# EAGLE schematic giarduino-v02 (EAGLE 5.10)
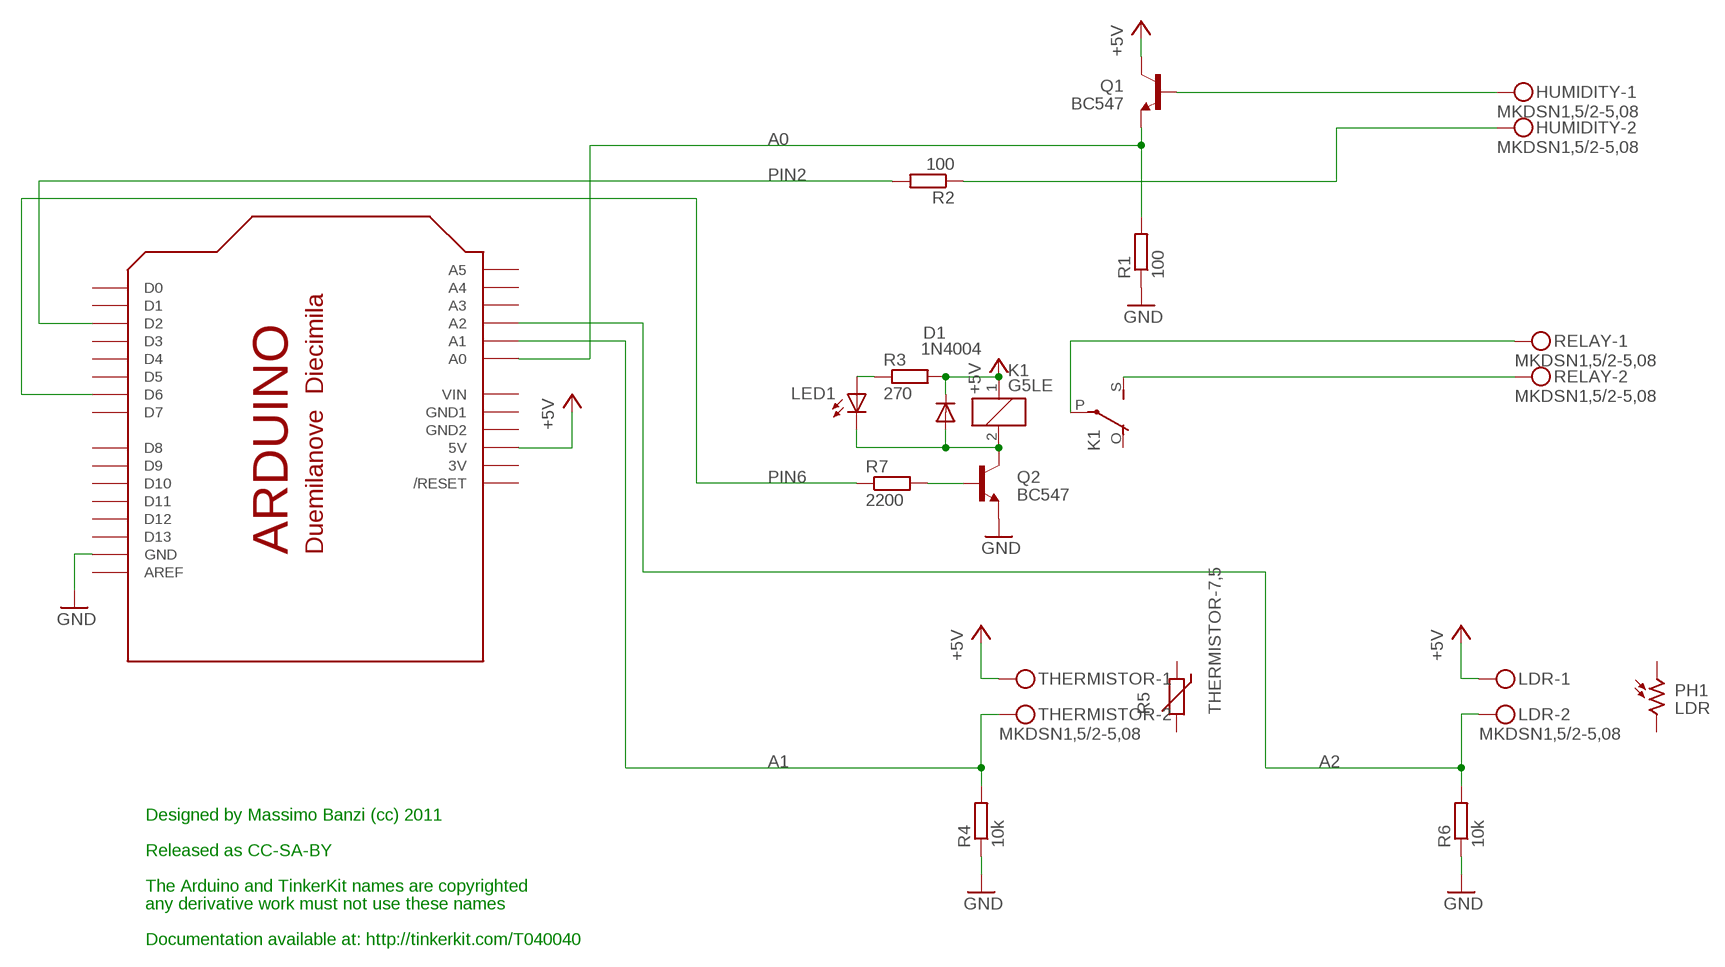
[diagram p0: schematic, sheet 1]

## Parts
D1  1N4004  [DO41-10]
HUMIDITY  MKDSN1,5/2-5,08  [MKDSN1,5/2-5,08]
K1  G5LE  [G5LE]
LDR  MKDSN1,5/2-5,08  [MKDSN1,5/2-5,08]
LED1  LED3MM  [LED3MM]
PH1  LDR  VT80N1  [VT800]
Q1  BC547  TRANSISTOR_NPNTO92  [TO-92]
Q2  BC547  TRANSISTOR_NPNTO92  [TO-92]
R1  100  R-EU_0207/10  [0207/10]
R2  100  R-EU_0207/10  [0207/10]
R3  270  R-EU_0207/10  [0207/10]
R4  10k  R-EU_0207/10  [0207/10]
R5  THERMISTOR-7,5  [R-7,5]
R6  10k  R-EU_0207/10  [0207/10]
R7  2200  R-EU_0207/10  [0207/10]
RELAY  MKDSN1,5/2-5,08  [MKDSN1,5/2-5,08]
THERMISTOR  MKDSN1,5/2-5,08  [MKDSN1,5/2-5,08]
U$1  ARDUINOUNO  [ARDUINO]

## Nets
+5V [pwr]: D1.C K1.1 LDR.1 Q1.3(C) R3.2 THERMISTOR.1 U$1.5V
A0: Q1.1(E) R1.2 U$1.A0
A1: R4.2 THERMISTOR.2 U$1.A1
A2: LDR.2 R6.2 U$1.A2
GND [pwr]: Q2.1(E) R1.1 R4.1 R6.1 U$1.GND
N$1: D1.A K1.2 LED1.K(C) Q2.3(C)
N$2: Q2.2(B) R7.2
N$3 [pwr]: K1.S(2:S) RELAY.2
N$4 [pwr]: K1.P(2:P) RELAY.1
N$11: LED1.A R3.1
N$13: HUMIDITY.2 R2.1
PIN2: R2.2 U$1.D2
PIN6: R7.1 U$1.D6
PROBE-TRANSISTORIN: HUMIDITY.1 Q1.2(B)
Unconnected: K1.O(2:O) PH1.1 PH1.2 R5.1 R5.2 U$1.A3 U$1.A4 U$1.A5 U$1.AREF U$1.D0 U$1.D1 U$1.D3 U$1.D4 U$1.D5 U$1.D7 U$1.D8 U$1.D9 U$1.D10 U$1.D11 U$1.D12 U$1.D13 U$1.RESET(/RESET)

## Notes on the sheet
- Designed by Massimo Banzi (cc) 2011
- Released as CC-SA-BY
- The Arduino and TinkerKit names are copyrighted
- any derivative work must not use these names
- Documentation available at: http://tinkerkit.com/T040040

## Power pins joined to a net without a drawn wire
3V: U$1.3V
GND1: U$1.GND1
GND2: U$1.GND2
VIN: U$1.VIN

## Library data of the parts
D1 = diode:1N4004: DIODE general purpose rectifier, 1 A
HUMIDITY LDR RELAY THERMISTOR = con-phoenix-508:MKDSN1,5/2-5,08: MKDSN 1,5/ 2-5,08 Printklemme Nennstrom: 13,5 A Nennspannung: 250 V Rastermaß: 5,08 mm Polzahl: 2 Anschlussart: Schraubanschluss Montage: Löten Anschlussrichtung Leiter/Platine: 0 ° Artikelnummer: 1729128 Source: http://eshop.phoenixcontact.com .. 1729128.pdf
K1 = relay:G5LE: RELAY 1 x switch, 10 A/120 V AC, 8 A/30 V DC, Omron
LED1 = SparkFun:LED: LEDs Standard schematic elements and footprints for 5mm, 3mm, 1206, and 0603 sized LEDs. 5mm - Spark Fun Electronics SKU : COM-00529 (and others)
PH1 = photo-elements:VT8: Photoconductive Cell VT800 Series Source: http://optoelectronics.perkinelmer.com/content/Datasheets/DTS_vt800seriesdatasheet.pdf
Q1 Q2 = SparkFun:TRANSISTOR_NPN: Transistor NPN BJT configuration in SOT23 package. MMBT2222 is the common NPN we use. Double check BCE configuration again layout.
R1-R4 R6 R7 = resistor:R-EU_: RESISTOR, European symbol
R5 = varistor:THERMISTOR: THERMISTOR
U$1 = adafruit:ARDUINO: Arduino Diecimila/Duemilanove Make a shield with ease, this package has all the named pins as well as the two mounting drill holes and an outline of the USB and DC power connector. The outline is on the DIMENSION layer, so if your board house uses it they will cut the outline to match. http://www.ladyada.net/library/pcb/eaglelibrary.html

## Net classes
0 default: width 0.508 mm, clearance 0.356 mm
1 pwr: width 0.813 mm, clearance 0.356 mm